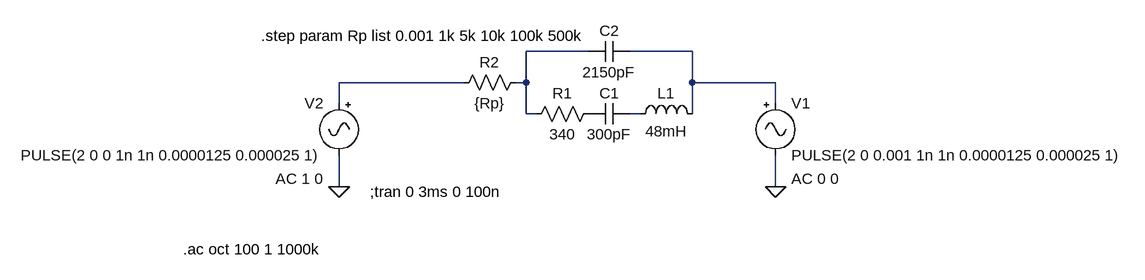
[diagram p0: schematic series-resitor-test.asc]
series-resitor-test.asc, the LTspice schematic file:
Version 4
SHEET 1 880 680
WIRE -80 32 -176 32
WIRE 80 32 -16 32
WIRE -272 80 -464 80
WIRE -176 80 -176 32
WIRE -176 80 -192 80
WIRE 80 80 80 32
WIRE 208 80 80 80
WIRE -464 112 -464 80
WIRE 208 112 208 80
WIRE -176 128 -176 80
WIRE -160 128 -176 128
WIRE 0 128 -16 128
WIRE 80 128 80 80
WIRE -464 240 -464 192
WIRE 208 240 208 192
FLAG -464 240 0
FLAG 208 240 0
SYMBOL cap -80 112 M90
WINDOW 0 0 32 VBottom 2
WINDOW 3 32 32 VTop 2
SYMATTR InstName C1
SYMATTR Value 300pF
SYMBOL cap -80 48 R270
WINDOW 0 32 32 VTop 2
WINDOW 3 0 32 VBottom 2
SYMATTR InstName C2
SYMATTR Value 2150pF
SYMBOL res -176 144 R270
WINDOW 0 32 56 VTop 2
WINDOW 3 0 56 VBottom 2
SYMATTR InstName R1
SYMATTR Value 340
SYMBOL ind -16 144 R270
WINDOW 0 32 56 VTop 2
WINDOW 3 5 56 VBottom 2
SYMATTR InstName L1
SYMATTR Value 48mH
SYMBOL Misc\\signal -464 96 M0
WINDOW 123 24 132 Left 2
WINDOW 39 0 0 Left 2
SYMATTR InstName V2
SYMATTR Value PULSE(2 0 0 1n 1n 0.0000125 0.000025 1)
SYMATTR Value2 AC 1 0
SYMBOL res -176 64 R90
WINDOW 0 0 56 VBottom 2
WINDOW 3 32 56 VTop 2
SYMATTR InstName R2
SYMATTR Value {Rp}
SYMBOL Misc\\signal 208 96 R0
WINDOW 123 24 132 Left 2
WINDOW 39 0 0 Left 2
SYMATTR InstName V1
SYMATTR Value PULSE(2 0 0.001 1n 1n 0.0000125 0.000025 1)
SYMATTR Value2 AC 0 0
TEXT -416 248 Left 2 !;tran 0 3ms 0 100n
TEXT -584 8 Left 2 !.step param Rp list 0.001 1k 5k 10k 100k 500k
TEXT -704 336 Left 2 !.ac oct 100 1 1000k

The netlist it stands for:
* series-resitor-test.asc
C1 P001 N004 300pF
C2 N001 N002 2150pF
R1 N001 P001 340
L1 N004 N002 48mH
V2 N003 0 PULSE(2 0 0 1n 1n 0.0000125 0.000025 1) AC 1 0
R2 N001 N003 {Rp}
V1 N002 0 PULSE(2 0 0.001 1n 1n 0.0000125 0.000025 1) AC 0 0
;tran 0 3ms 0 100n
.step param Rp list 0.001 1k 5k 10k 100k 500k
.ac oct 100 1 1000k
.backanno
.end